# Altium schematic sheet motor_DRV.SchDoc
size A4; SheetNumber: 2; SheetTotal: 3
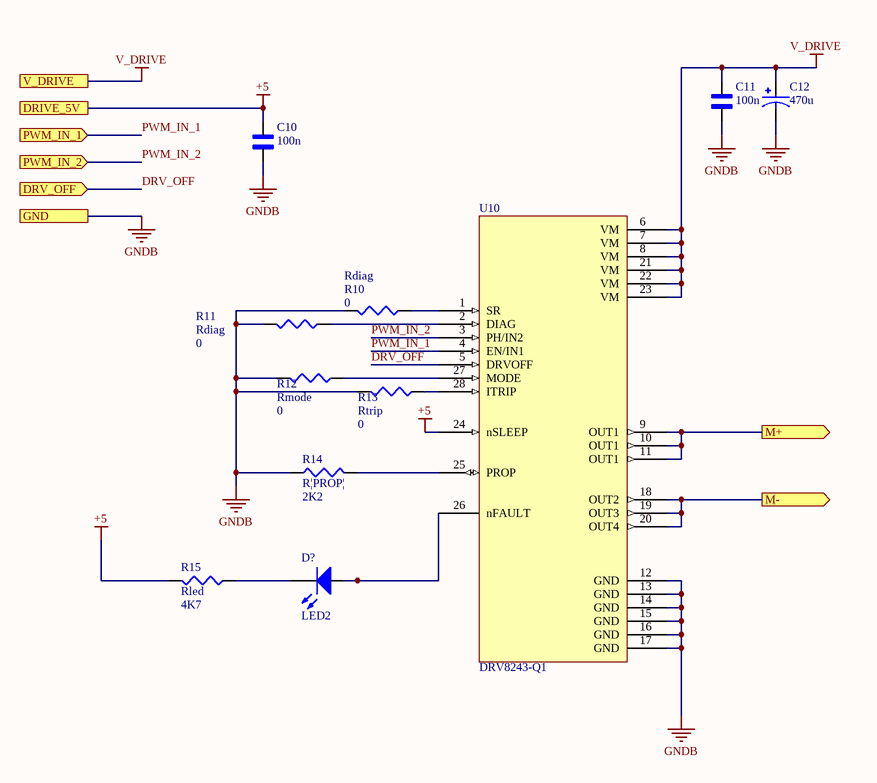
[diagram p0: motor_DRV.SchDoc]

## Parts
C10  100n  [CAPC2012X135N]
C11  100n  [CAPC2012X135N]
C12  470u  [CAPPRD500W60D800H1500]
D?  LED2  [3.2X1.6X1.1]
R10  Rdiag  value 0  [J1-0603]
R11  Rdiag  value 0  [J1-0603]
R12  Rmode  value 0  [J1-0603]
R13  Rtrip  value 0  [J1-0603]
R14  R|PROP|  value 2K2  [J1-0603]
R15  Rled  value 4K7  [J1-0603]
U10  DRV8243-Q1  [IC_DRV8873SPWPRQ1]

## Ports
DRIVE_5V, DRV_OFF (in), GND, M+ (out), M- (out), PWM_IN_1 (in), PWM_IN_2 (in), V_DRIVE

## Nets
+5: C10.1 R15.2 U10.24(nSLEEP) ; port DRIVE_5V
GNDB: C10.2 C11.2 C12.N R10.2 R11.2 R12.2 R13.2 R14.1 U10.12(GND) U10.13(GND) U10.14(GND) U10.15(GND) U10.16(GND) U10.17(GND) ; port GND
V_DRIVE: C11.1 C12.P U10.6(VM) U10.7(VM) U10.8(VM) U10.21(VM) U10.22(VM) U10.23(VM) ; port V_DRIVE
DRV_OFF: U10.5(DRVOFF) ; port DRV_OFF
M+: U10.9(OUT1) U10.10(OUT1) U10.11(OUT1) ; port M+
M-: U10.18(OUT2) U10.19(OUT3) U10.20(OUT4) ; port M-
PWM_IN_1: U10.4(EN/IN1) ; port PWM_IN_1
PWM_IN_2: U10.3(PH/IN2) ; port PWM_IN_2
NetD?_1: D?.1(A) U10.26(nFAULT)
NetD?_2: D?.2(K) R15.1
NetR10_1: R10.1 U10.1(SR)
NetR11_1: R11.1 U10.2(DIAG)
NetR12_1: R12.1 U10.27(MODE)
NetR13_1: R13.1 U10.28(ITRIP)
NetR14_2: R14.2 U10.25(PROP)

## Library data of the parts
C10 C11 = GRM21BR60G107ME15K: Ceramic Capacitor; MF: Murata; Price: None; Value: *; Mouser-Purchase-URL: https://snapeda.com/shop?store=Mouser&id=1982998; Package: 0805 Murata; SnapEDA_Link: https://www.snapeda.com/parts/GRM21BR60G107ME15K/Murata/view-part/1982998/?ref=snap; Availability: Warning; MP: GRM21BR60G107ME15K; BuyPart: https://www.snapeda.com/parts/GRM21BR60G107ME15K/Murata/view-part/1982998/?ref=eda
C12 = EEUFR1E471YB: 470F 25V Aluminum Electrolytic Capacitors Radial, Can 8000 Hrs @ 105C; MF: Panasonic; Value: *; Price: None; Availability: In Stock; SnapEDA_Link: https://www.snapeda.com/parts/EEUFR1E471YB/Panasonic/view-part/5797024/?ref=snap; Check_prices: https://www.snapeda.com/parts/EEUFR1E471YB/Panasonic/view-part/5797024/?ref=eda; Package: RADIAL-2 Panasonic; MP: EEUFR1E471YB
D? = LED2: Typical RED, GREEN, YELLOW, AMBER GaAs LED; Published: 8-Jun-2000; LatestRevisionDate: 17-Jul-2002; LatestRevisionNote: Re-released for DXP Platform.; PackageVersion: Feb-2002; PackageReference: 3.2X1.6X1.1; Publisher: Altium Limited; PackageDescription: SM LED; 2 Flat Leads
R10-R15 = Res3: Resistor; Published: 8-Jun-2000; LatestRevisionDate: 29-May-2009; LatestRevisionNote: IPC-7351 Footprint Added.; PackageReference: J1-0603; Publisher: Altium Limited; PackageDescription: Chip Resistor